# Altium schematic sheet GPS.SchDoc
size A; SheetNumber: 5; SheetTotal: 5
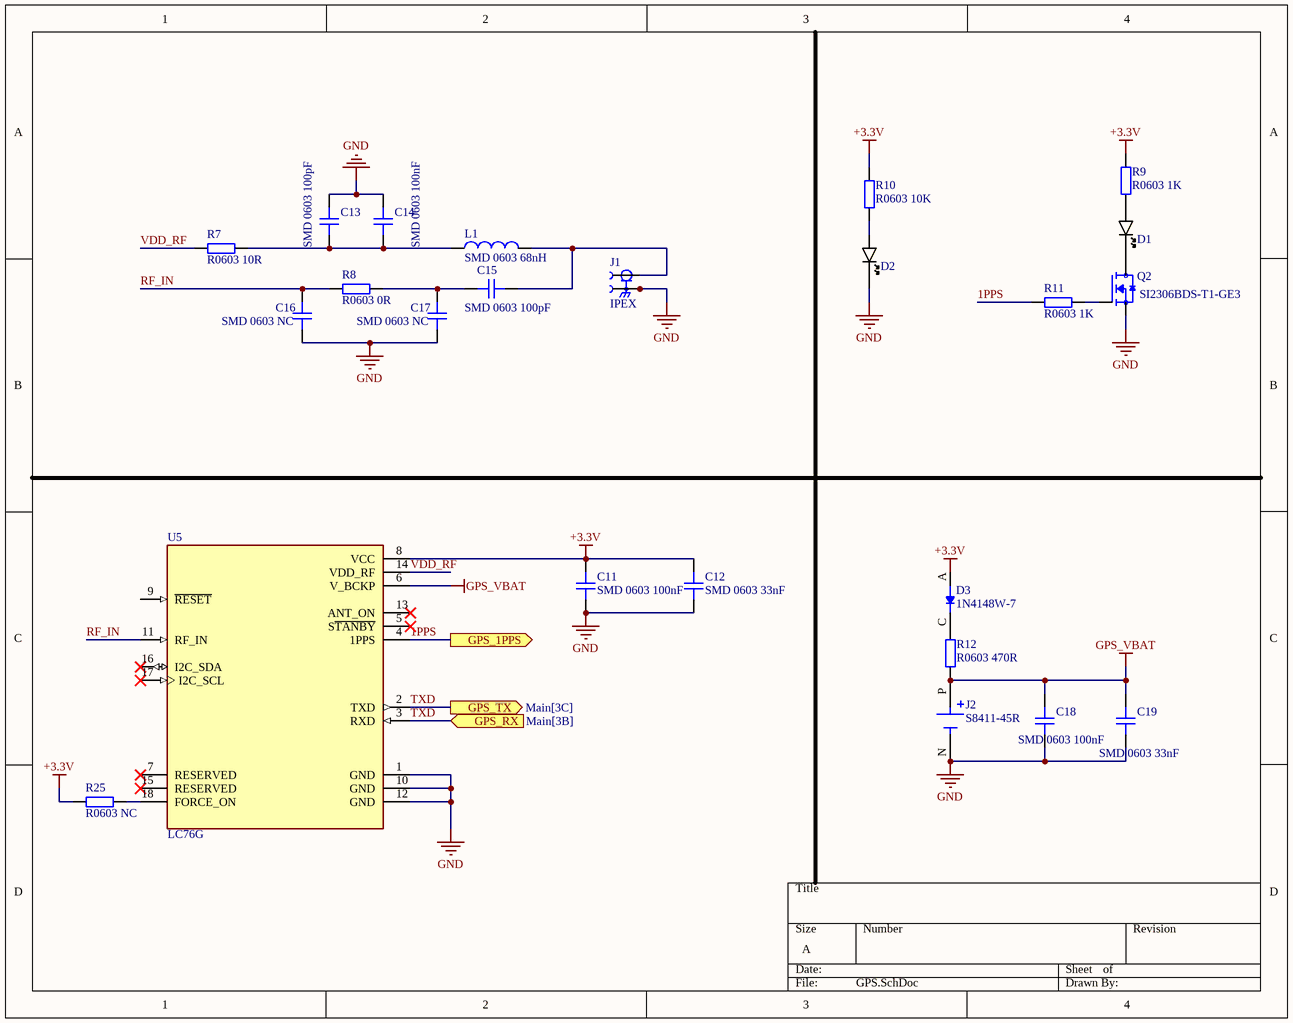
[diagram p0: GPS.SchDoc]

## Parts
C11  SMD 0603 100nF  [CAP_0603]
C12  SMD 0603 33nF  [CAP_0603]
C13  SMD 0603 100pF  [CAP_0603]
C14  SMD 0603 100nF  [CAP_0603]
C15  SMD 0603 100pF  [CAP_0603]
C16  SMD 0603 NC  [NC_0603]
C17  SMD 0603 NC  [NC_0603]
C18  SMD 0603 100nF  [CAP_0603]
C19  SMD 0603 33nF  [CAP_0603]
D1  BLUE  [LED_0805]  (value not drawn)
D2  (no value)  [LED_0805]
D3  1N4148W-7  [SOD3715X135N]
J1  IPEX  [IPEX_20279-001E-03]
J2  S8411-45R  [HARWIN_S8411-45R]
L1  SMD 0603 68nH  [0603 INDUCTOR]
Q2  SI2306BDS-T1-GE3  [SOT95P237X112-3N]
R7  R0603 10R  [RES_0603]
R8  R0603 0R  [RES_0603]
R9  R0603 1K  [RES_0603]
R10  R0603 10K  [RES_0603]
R11  R0603 1K  [RES_0603]
R12  R0603 470R  [RES_0603]
R25  R0603 NC  [NC_0603]
U5  LC76G  [XCVR_LC76G]

## Ports
GPS_1PPS (out), GPS_RX (in, see Main[3B]), GPS_TX (out, see Main[3C])

## Nets
+3.3V: C11.2 C12.2 D3.A R9.2 R10.2 R25.1 U5.8(VCC)
GND: C11.1 C12.1 C13.2 C14.2 C16.2 C17.2 C18.1 C19.1 D2.K J1.2(GROUND) J1.3(GROUND) J2.N(NEG) Q2.2(S) U5.1(GND) U5.10(GND) U5.12(GND)
GPS_VBAT: C18.2 C19.2 J2.P(POS) R12.1 U5.6(V_BCKP)
1PPS: R11.2 U5.4(1PPS) ; port GPS_1PPS
RF_IN: C16.1 R8.1 U5.11(RF_IN)
TXD: U5.2(TXD) U5.3(RXD) ; port GPS_RX, port GPS_TX
VDD_RF: R7.1 U5.14(VDD_RF)
NetC13_1: C13.1 C14.1 L1.1 R7.2
NetC15_1: C15.1 C17.1 R8.2
NetC15_2: C15.2 J1.1(SIGNAL) L1.2
NetD1_A: D1.A R9.1
NetD1_K: D1.K Q2.3(D)
NetD2_A: D2.A R10.1
NetD3_C: D3.C(K) R12.2
NetQ2_1: Q2.1(G) R11.1
NetR25_2: R25.2 U5.18(FORCE_ON)

Not connected (* = marked no-connect by the designer): U5 5(S~{TANBY})* 7(RESERVED)* 9(~{RESET}) 13(ANT_ON)* 15(RESERVED)* 16(I2C_SDA)* 17(I2C_SCL)*

## Library data of the parts
C11-C19 = CAP_0603: Capacitor SMD 0603; Manufacturer: *; Manufacturer Part Number: *; Distributor Link: *; LCSC: *; Rating: *; Dielectric: *
D1 D2 = LED_0805: LED 0805 BLUE SMD; Manufacturer: *; Manufacturer Part Number: *; Distributor Link: *; LCSC: *
D3 = 1N4148W-7: Diode Standard 100 V 300mA (DC) Surface Mount SOD-123; MF: Diodes Inc.; SnapEDA_Link: https://www.snapeda.com/parts/1N4148W-7/Diodes+Inc./view-part/?ref=snap; Package: SOD-123 Fairchild Semiconductor; MP: 1N4148W-7; Check_prices: https://www.snapeda.com/parts/1N4148W-7/Diodes+Inc./view-part/?ref=eda; Purchase-URL: https://pricing.snapeda.com/search/part/1N4148W-7/?ref=eda; Price: None; Value: *; Availability: In Stock
J1 = IPEX: 1 POS Vertical SMD Small form factor with big performance through 6 GHz connector,MHF, RF, micro-coaxial MHF I Receptacle; MF: I-PEX; MP: 20279-001E-03; SnapEDA_Link: https://www.snapeda.com/parts/20279-001E-03/I-PEX/view-part/?ref=snap; Package: None; Value: *; Check_prices: https://www.snapeda.com/parts/20279-001E-03/I-PEX/view-part/?ref=eda
J2 = S8411-45R: Coin Cell Battery Retainer, Horizontal SMT, for CR1220 Coin Cell Batteries, Tape & Reeled; MF: Harwin; SnapEDA_Link: https://www.snapeda.com/parts/S8411-45R/Harwin+Inc./view-part/?ref=snap; Package: None; Value: *; MP: S8411-45R; Check_prices: https://www.snapeda.com/parts/S8411-45R/Harwin+Inc./view-part/?ref=eda
L1 = INDUCTOR_0603: Inductor with 0603 (1608); MP: LQW18AS22NG0CD; MF: Murata; Purchase-URL: https://pricing.snapeda.com/search/part/LQW18AS22NG0CD/?ref=eda; Value: *; Availability: Warning; Package: 1608 Murata; SnapEDA_Link: https://www.snapeda.com/parts/LQW18AS22NG0CD/Murata/view-part/4476690/?ref=snap; Price: None; Check_prices: https://www.snapeda.com/parts/LQW18AS22NG0CD/Murata/view-part/4476690/?ref=eda
Q2 = SI2306BDS-T1-GE3: N-Channel 30 V 3.16A (Ta) 750mW (Ta) Surface Mount SOT-23-3 (TO-236); MF: Vishay Siliconix; SnapEDA_Link: https://www.snapeda.com/parts/SI2306BDS-T1-GE3/Vishay/view-part/?ref=snap; Package: SOT-23-3 Vishay Siliconix; Value: *; MP: SI2306BDS-T1-GE3; Check_prices: https://www.snapeda.com/parts/SI2306BDS-T1-GE3/Vishay/view-part/?ref=eda
R7-R12 R25 = RES_0603: Resistor SMD 0603; Manufacturer: *; Manufacturer Part Number: *; Distributor Link: *; LCSC: *
U5 = LC76G: MF: Quectel; Package: None; Price: None; Value: *; MP: LC76G; Availability: Unavailable